# EAGLE design hydra (EAGLE 5.06)
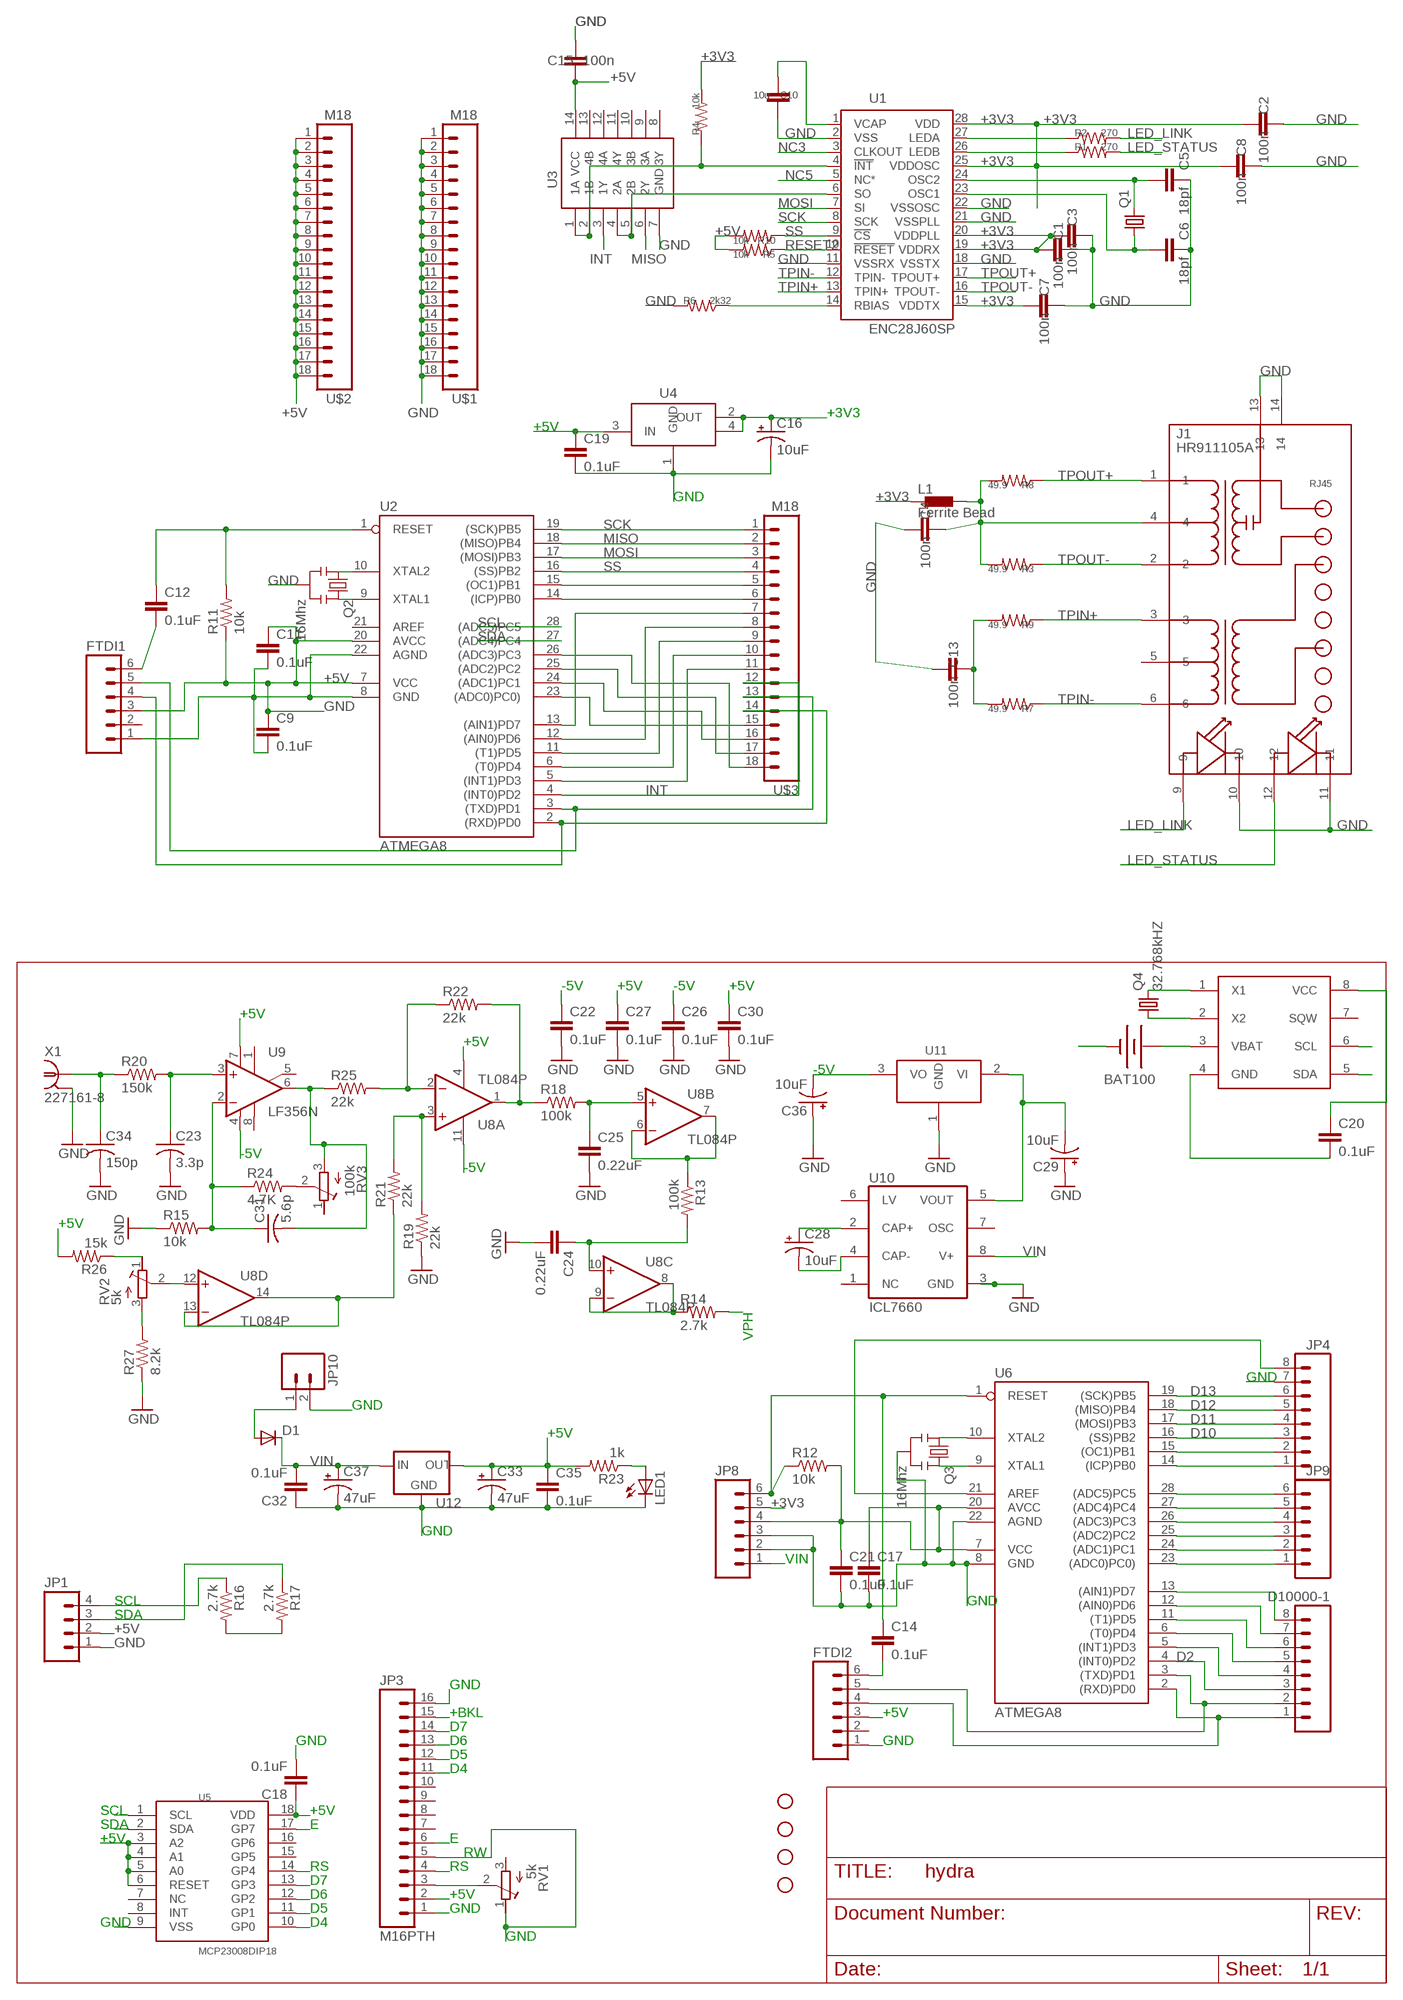
[diagram p0: schematic, sheet 1]

## Parts
BAT100  BATTERY12PTH_KEYSTONE  [BATT_12MM_KEYSTONE]
C1  100n  CAPPTH  [CAP-PTH-SMALL]
C2  100n  CAPPTH  [CAP-PTH-SMALL]
C3  100n  CAPPTH  [CAP-PTH-SMALL]
C4  100n  CAPPTH  [CAP-PTH-SMALL]
C5  18pf  CAPPTH  [CAP-PTH-SMALL]
C6  18pf  CAPPTH  [CAP-PTH-SMALL]
C7  100n  CAPPTH  [CAP-PTH-SMALL]
C8  100n  CAPPTH  [CAP-PTH-SMALL]
C9  0.1uF  CAPPTH  [CAP-PTH-SMALL]
C10  10u  CAPPTH  [CAP-PTH-SMALL]
C11  0.1uF  CAPPTH  [CAP-PTH-SMALL]
C12  0.1uF  CAPPTH  [CAP-PTH-SMALL]
C13  100n  CAPPTH  [CAP-PTH-SMALL]
C14  0.1uF  CAPPTH  [CAP-PTH-SMALL]
C15  100n  CAPPTH  [CAP-PTH-SMALL]
C16  10uF  CAP_POL5MMPTH  [CAP5MM2MM]
C17  0.1uF  CAPPTH  [CAP-PTH-SMALL]
C18  0.1uF  CAPPTH  [CAP-PTH-SMALL]
C19  0.1uF  CAPPTH  [CAP-PTH-SMALL]
C20  0.1uF  CAPPTH  [CAP-PTH-SMALL]
C21  0.1uF  CAPPTH  [CAP-PTH-SMALL]
C22  0.1uF  CAPPTH  [CAP-PTH-SMALL]
C23  3.3p  C-US025-025X050  [C025-025X050]
C24  0.22uF  CAPPTH  [CAP-PTH-SMALL]
C25  0.22uF  CAPPTH  [CAP-PTH-SMALL]
C26  0.1uF  CAPPTH  [CAP-PTH-SMALL]
C27  0.1uF  CAPPTH  [CAP-PTH-SMALL]
C28  10uF  CPOL-USE2-5  [E2-5]
C29  10uF  CPOL-USE2-5  [E2-5]
C30  0.1uF  CAPPTH  [CAP-PTH-SMALL]
C31  5.6p  C-US025-025X050  [C025-025X050]
C32  0.1uF  CAPPTH  [CAP-PTH-SMALL]
C33  47uF  CAP_POL6.3MMPTH  [CAP6.3MM2.5MM]
C34  150p  C-US025-025X050  [C025-025X050]
C35  0.1uF  CAPPTH  [CAP-PTH-SMALL]
C36  10uF  CPOL-USE2-5  [E2-5]
C37  47uF  CAP_POL6.3MMPTH  [CAP6.3MM2.5MM]
D1  DIODEPTH  [DIODE-1N4001]
D10000-1  M08  [1X08]
FTDI1  M06SIP  [1X06]
FTDI2  M06SIP  [1X06]
J1  HR911105A  [HR911105A]
JP1  M04PTH  [1X04]
JP2  STAND-OFF  [STAND-OFF]
JP3  M16PTH  [1X16]
JP4  M08  [1X08]
JP5  STAND-OFF  [STAND-OFF]
JP6  STAND-OFF  [STAND-OFF]
JP7  STAND-OFF  [STAND-OFF]
JP8  M06SIP  [1X06]
JP9  M06SIP  [1X06]
JP10  M02POLAR  [MOLEX-1X2]
L1  Ferrite Bead  BL01RN1A  [BL01RN1A]
LED1  LED3MM  [LED3MM]
Q1  CRYSTALHC49S  [HC49/S]
Q2  16Mhz  RESONATORPTH  [RESONATOR-PTH]
Q3  16Mhz  RESONATORPTH  [RESONATOR-PTH]
Q4  32.768kHZ  CRYSTALTC26H  [TC26H]
R1  270  R-US_0204/7  [0204/7]
R2  270  R-US_0204/7  [0204/7]
R3  49.9  R-US_0204/7  [0204/7]
R4  10k  R-US_0204/7  [0204/7]
R5  10k  R-US_0204/7  [0204/7]
R6  2k32  R-US_0204/7  [0204/7]
R7  49.9  R-US_0204/7  [0204/7]
R8  49.9  R-US_0204/7  [0204/7]
R9  49.9  R-US_0204/7  [0204/7]
R10  10k  R-US_0204/7  [0204/7]
R11  10k  R-US_0204/7  [0204/7]
R12  10k  R-US_0204/7  [0204/7]
R13  100k  R-US_0204/7  [0204/7]
R14  2.7k  R-US_0204/7  [0204/7]
R15  10k  R-US_0204/7  [0204/7]
R16  2.7k  R-US_0204/7  [0204/7]
R17  2.7k  R-US_0204/7  [0204/7]
R18  100k  R-US_0204/7  [0204/7]
R19  22k  R-US_0204/7  [0204/7]
R20  150k  R-US_0204/7  [0204/7]
R21  22k  R-US_0204/7  [0204/7]
R22  22k  R-US_0204/7  [0204/7]
R23  1k  R-US_0204/7  [0204/7]
R24  4.7K  R-US_0204/7  [0204/7]
R25  22k  R-US_0204/7  [0204/7]
R26  15k  R-US_0204/7  [0204/7]
R27  8.2k  R-US_0204/7  [0204/7]
RV1  5k  R-TRIMMT93YA  [RTRIMT93YA]
RV2  5k  R-TRIMMT93YA  [RTRIMT93YA]
RV3  100k  R-TRIMMT93YA  [RTRIMT93YA]
U1  ENC28J60SP  [DIL28-3]
U2  ATMEGA8  AT90S4433P  [DIL28-3]
U3  SN74HCT08NDIL14  [DIL14]
U4  LD1117  [SOT223]
U5  MCP23008DIP18  [DIL18]
U6  ATMEGA8  AT90S4433P  [DIL28-3]
U7  DS1307DS1307  [DIP08]
U8  TL084P  [DIL14]
U9  LF356N  [DIL08]
U10  ICL7660  ICL7660CPA  [DIL08]
U11  79XX  [TO92-]
U12  V_REG_78XXTO252  [TO252]
U$1  M18  [1X18]
U$2  M18  [1X18]
U$3  M18  [1X18]
X1  227161-8  [AMP_227161]

## Nets
+3V3: C1.2 C2.2 C3.2 C7.2 C8.2 C16.+ JP8.5 L1.1 R4.2 U1.15(VDDTX) U1.19(VDDRX) U1.20(VDDPLL) U1.25(VDDOSC) U1.28(VDD) U4.2(OUT) U4.4(TAB)
+5V [power]: C9.1 C11.1 C15.2 C17.1 C18.1 C19.1 C20.1 C21.1 C27.1 C30.1 C33.P$2(+) C35.1 FTDI1.3 FTDI2.3 JP1.2 JP3.2 JP8.4 R5.2 R10.2 R11.1 R12.2 R16.2 R17.2 R23.2 R26.2 U2.7(VCC) U2.20(AVCC) U3.14(VCC) U4.3(IN) U5.3(A2) U5.4(A1) U5.5(A0) U5.6(RESET) U5.18(VDD) U6.7(VCC) U6.20(AVCC) U7.8(VCC) U8.4(P:V+) U9.7(V+) U12.2(OUT) U$2.1 U$2.2 U$2.3 U$2.4 U$2.5 U$2.6 U$2.7 U$2.8 U$2.9 U$2.10 U$2.11 U$2.12 U$2.13 U$2.14 U$2.15 U$2.16 U$2.17 U$2.18
+BKL: JP3.15 JP4.1 U6.14((ICP)PB0)
-5V [power]: C22.1 C26.1 C36.- U8.11(P:V-) U9.4(V-) U11.3(VO)
BUZZ: D10000-1.8 U6.13((AIN1)PD7)
D2: D10000-1.3 U6.4((INT0)PD2)
D4: JP3.11 U5.10(GP0)
D5: JP3.12 U5.11(GP1)
D6: JP3.13 U5.12(GP2)
D7: JP3.14 U5.13(GP3)
D10: JP4.3 U6.16((SS)PB2)
D11: JP4.4 U6.17((MOSI)PB3)
D12: JP4.5 U6.18((MISO)PB4)
D13: JP4.6 U6.19((SCK)PB5)
E: JP3.6 U5.17(GP7)
GND [power]: BAT100.GND(-) C1.1 C2.1 C3.1 C4.2 C5.1 C6.1 C7.1 C8.1 C9.2 C10.1 C11.2 C13.2 C15.1 C16.- C17.2 C18.2 C19.2 C20.2 C21.2 C22.2 C23.2 C24.2 C25.2 C26.2 C27.2 C29.+ C30.2 C32.1 C33.P$1(-) C34.2 C35.2 C36.+ C37.P$1(-) FTDI1.1 FTDI2.1 J1.10 J1.11 J1.13 J1.14 JP1.1 JP3.1 JP3.5 JP3.16 JP4.7 JP8.2 JP8.3 JP10.2 LED1.K(C) Q2.2 Q3.2 R6.2 R15.1 R19.1 R27.1 RV1.1(A) U1.2(VSS) U1.11(VSSRX) U1.18(VSSTX) U1.21(VSSPLL) U1.22(VSSOSC) U2.8(GND) U2.22(AGND) U3.7(GND) U4.1(GND) U5.9(VSS) U6.8(GND) U6.22(AGND) U7.4(GND) U10.3(GND) U11.1(GND) U12.3(GND) U$1.1 U$1.2 U$1.3 U$1.4 U$1.5 U$1.6 U$1.7 U$1.8 U$1.9 U$1.10 U$1.11 U$1.12 U$1.13 U$1.14 U$1.15 U$1.16 U$1.17 U$1.18 X1.2(GND)
INT: U2.4((INT0)PD2) U3.3(1Y) U$3.12
IR: D10000-1.5 U6.6((T0)PD4)
LED_LINK: J1.9 R2.2
LED_STATUS: J1.12 R1.2
MISO: U2.18((MISO)PB4) U3.6(2Y) U$3.2
MOSI: U1.7(SI) U2.17((MOSI)PB3) U$3.3
N$1: Q4.1 U7.2(X2)
N$2: Q4.2 U7.1(X1)
N$3: BAT100.V+(+) U7.3(VBAT)
N$4: C28.+ U10.2(CAP+)
N$5: C28.- U10.4(CAP-)
N$6: C31.2 R25.1 RV3.3(E) U9.6(OUT)
N$7: R22.1 R25.2 U8.2(A:-IN)
N$8: C23.1 R20.2 U9.3(+IN)
N$10: JP3.3 RV1.2(S)
N$11: R24.2 RV3.2(S)
N$12: R19.2 R21.2 U8.3(A:+IN)
N$13: C34.1 R20.1 X1.1
N$14: C31.1 R15.2 R24.1 U9.2(-IN)
N$15: R18.1 R22.2 U8.1(A:OUT)
N$16: C25.1 R18.2 U8.5(B:+IN)
N$17: R13.1 U8.6(B:-IN) U8.7(B:OUT)
N$18: C24.1 R13.2 U8.10(C:+IN)
N$19: RV2.2(S) U8.12(D:+IN)
N$20: R21.1 U8.13(D:-IN) U8.14(D:OUT)
N$21: R14.1 U8.8(C:OUT) U8.9(C:-IN)
N$22: R26.1 RV2.1(A)
N$23: R27.2 RV2.3(E)
N$24: LED1.A R23.1
N$25: D10000-1.4 U6.5((INT1)PD3)
N$26: U2.26((ADC3)PC3) U$3.18
N$27: U2.25((ADC2)PC2) U$3.17
N$28: D10000-1.6 U6.11((T1)PD5)
N$29: D10000-1.7 U6.12((AIN0)PD6)
N$30: C10.2 U1.1(VCAP)
N$31: JP9.1 U6.23((ADC0)PC0))
N$32: JP9.2 U6.24((ADC1)PC1)
N$33: R6.1 U1.14(RBIAS)
N$34: JP9.3 U6.25((ADC2)PC2)
N$35: C4.1 J1.4 L1.2 R3.2 R8.2
N$36: Q3.3 U6.9(XTAL1)
N$37: C13.1 R7.2 R9.2
N$38: Q3.1 U6.10(XTAL2)
N$39: R2.1 U1.27(LEDA)
N$40: JP4.2 U6.15((OC1)PB1)
N$42: R1.1 U1.26(LEDB)
N$43: D1.A JP10.1
N$45: JP4.8 U6.21(AREF)
N$47: U2.24((ADC1)PC1) U$3.16
N$49: D10000-1.1 FTDI2.4 U6.2((RXD)PD0)
N$50: D10000-1.2 FTDI2.5 U6.3((TXD)PD1)
N$51: C14.2 FTDI2.6
N$52: U2.23((ADC0)PC0)) U$3.15
N$53: FTDI1.4 U2.2((RXD)PD0) U$3.14
N$54: FTDI1.5 U2.3((TXD)PD1) U$3.13
N$56: U2.5((INT1)PD3) U$3.11
N$57: U2.6((T0)PD4) U$3.10
N$58: U2.11((T1)PD5) U$3.9
N$59: U2.12((AIN0)PD6) U$3.8
N$60: U2.13((AIN1)PD7) U$3.7
N$61: U2.14((ICP)PB0) U$3.6
N$62: U2.15((OC1)PB1) U$3.5
N$67: Q2.1 U2.10(XTAL2)
N$68: Q2.3 U2.9(XTAL1)
N$69: C12.2 FTDI1.6
NC3: U1.3(CLKOUT)
NC5: U1.5(NC*)
OSC1: C6.2 Q1.1 U1.23(OSC1)
OSC2: C5.2 Q1.2 U1.24(OSC2)
RESET: C14.1 JP8.6 R12.1 U6.1(RESET)
RESET2: C12.1 R5.1 R11.2 U1.10(!RESET) U2.1(RESET)
RS: JP3.4 U5.14(GP4)
SCK: U1.8(SCK) U2.19((SCK)PB5) U$3.1
SCL: JP1.4 JP9.6 R16.1 U2.28((ADC5)PC5) U5.1(SCL) U6.28((ADC5)PC5) U7.6(SCL)
SDA: JP1.3 JP9.5 R17.1 U2.27((ADC4)PC4) U5.2(SDA) U6.27((ADC4)PC4) U7.5(SDA)
SS: R10.1 U1.9(!CS) U2.16((SS)PB2) U$3.4
TP1: R4.1 U1.4(!INT) U3.1(1A) U3.2(1B)
TP2: U1.6(SO) U3.4(2A) U3.5(2B)
TPIN+: J1.3 R9.1 U1.13(TPIN+)
TPIN-: J1.6 R7.1 U1.12(TPIN-)
TPOUT+: J1.1 R8.1 U1.17(TPOUT+)
TPOUT-: J1.2 R3.1 U1.16(TPOUT-)
U5VIN [power]: C29.- U10.5(VOUT) U11.2(VI)
VIN [power]: C32.2 C37.P$2(+) D1.C JP8.1 U10.8(V+) U12.1(IN)
VPH: JP9.4 R14.2 U6.26((ADC3)PC3)
Unconnected: FTDI1.2 FTDI2.2 J1.5 JP3.7 JP3.8 JP3.9 JP3.10 RV1.3(E) RV3.1(A) U2.21(AREF) U3.8(3Y) U3.9(3A) U3.10(3B) U3.11(4Y) U3.12(4A) U3.13(4B) U5.7(NC) U5.8(INT) U5.15(GP5) U5.16(GP6) U7.7(SQW) U9.1(ON1) U9.5(ON2) U9.8(OPT) U10.1(NC) U10.6(LV) U10.7(OSC)

## Notes on the sheet
- +3V3
- +5V
- GND
- -5V | +5V | -5V | +5V
- +5V
- +5V
- -5V
- -5V
- -5V
- +5V
- VPH
- GND
- GND
- +5V
- GND
- VIN
- SCL | GND
- SDA
- GND
- +BKL | +5V
- D7
- GND | D6 | GND
- D5
- D4
- SCL | +5V
- SDA | E
- +5V | E
- RW
- RS | RS
- D7
- D6 | +5V
- D5 | GND
- GND | D4
- GND

## Library data of the parts
BAT100 = _allyourbase:BATTERY: Battery Holders Various common sizes : AA, AAA, 20mm coin cell and 12mm coin cell.
C1-C15 C17-C22 C24-C27 C30 C32 C35 = _allyourbase:CAP: Capacitor Standard 0603 ceramic capacitor, and 0.1" leaded capacitor.
C16 C33 C37 = _allyourbase:CAP_POL: Capacitor Polarized These are standard SMD and PTH capacitors. Normally 10uF, 47uF, and 100uF in electrolytic and tantalum varieties. Always verify the external diameter of the through hole cap, it varies with capacity, voltage, and manufacturer. The EIA devices should be standard.
C23 C31 C34 = rcl:C-US: CAPACITOR, American symbol
C28 C29 C36 = rcl:CPOL-US: POLARIZED CAPACITOR, American symbol
D1 = _allyourbase:DIODE: Diode These are standard reverse protection diodes and small signal diodes. SMA package can handle up to about 1A. SOD-323 can handle about 200mA. What the SOD-323 package when ordering, there are some mfgs out there that are 5-pin packages.
D10000-1 JP4 = _allyourbase:M08: Header 8 Standard 8-pin 0.1" header. Use with straight break away headers (SKU : PRT-00116), right angle break away headers (PRT-00553), swiss pins (PRT-00743), machine pins (PRT-00117), and female headers (PRT-00115).
FTDI1 FTDI2 JP8 JP9 = _allyourbase:M06: Header 6 Standard 6-pin 0.1" header. Use with straight break away headers (SKU : PRT-00116), right angle break away headers (PRT-00553), swiss pins (PRT-00743), machine pins (PRT-00117), and female headers (PRT-00115). Molex polarized connector foot print use with SKU : PRT-08094 with associated crimp pins and housings. NOTES ON THE VARIANTS LOCK and LOCK_LONGPADS... This footprint was designed to help hold the alignment of a through-hole component (i.e. 6-pin header) while soldering it into place. You may notice that each hole has been shifted either up or down by 0.005 of an inch from it's more standard position (which is a perfectly straight line). This slight alteration caused the pins (the squares in the middle) to touch the edges of the holes. Because they are alternating, it causes a "brace" to hold the component in place. 0.005 has proven to be the perfect amount of "off-center" position when using our standard breakaway headers. Although looks a little odd when you look at the bare footprint, once you have a header in there, the alteration is very hard to notice. Also, if you push a header all the way into place, it is covered up entirely on the bottom side. This idea of altering the position of holes to aid alignment will be further integrated into the Sparkfun Library for other footprints. It can help hold any component with 3 or more connection pins.
J1 = _allyourbase:HR911105A
JP1 = _allyourbase:M04: Header 4 Standard 4-pin 0.1" header. Use with straight break away headers (SKU : PRT-00116), right angle break away headers (PRT-00553), swiss pins (PRT-00743), machine pins (PRT-00117), and female headers (PRT-00115). Molex polarized connector foot print use with SKU : PRT-08231 with associated crimp pins and housings.
JP2 JP5-JP7 = _allyourbase:STAND-OFF: Stand Off This is the mechanical footprint for a #4 phillips button head screw. Use the keepout ring to avoid running the screw head into surrounding components. SKU : PRT-00447
JP3 = SparkFun:M16
JP10 = _allyourbase:M02: Header 2 Standard 2-pin 0.1" header. Use with straight break away headers (SKU : PRT-00116), right angle break away headers (PRT-00553), swiss pins (PRT-00743), machine pins (PRT-00117), and female headers (PRT-00115). Molex polarized connector foot print use with SKU : PRT-08233 with associated crimp pins and housings.
L1 = inductors:BL0: Noise Suppression Products/EMI Suppression Filters, Lead EMIFIL(R) Inductor Type Source: http://www.murata.com .. BL01RN1_DS.pdf
LED1 = SparkFun:LED: LEDs Standard schematic elements and footprints for 5mm, 3mm, 1206, and 0603 sized LEDs. 5mm - Spark Fun Electronics SKU : COM-00529 (and others)
Q1 Q4 = _allyourbase:CRYSTAL: CRYSTAL
Q2 Q3 = _allyourbase:RESONATOR: Resonator Small SMD resonator. This is the itty bitty 10/20MHz resonators with built in caps. CSTCE10M0G55 and CSTCE20M0V53. Footprint has been reviewed closely but hasn't been tested yet.
R1-R27 = _allyourbase:R-US_: RESISTOR, American symbol
RV1-RV3 = resistor:R-TRIMM: Trimm resistor
U1 = _allyourbase:ENC28J60: Stand-Alone Ethernet Controller with SPI Interface Source: http://ww1.microchip.com/downloads/en/DeviceDoc/39662c.pdf
U2 U6 = atmel:AT90S4433: MICROCONTROLLER 4 Kbytes FLASH 128 bytes SRAM 256 bytes EEPROM UART 6-channel 10 bit ADC
U3 = _allyourbase:SN74HCT08N
U4 = _allyourbase:LD1117
U5 = _allyourbase:MCP23008
U7 = _allyourbase:DS1307
U8 = _allyourbase:TL084: OP AMP
U9 = _allyourbase:LF356: OP AMP
U10 = _allyourbase:ICL7660CPA: VOLTAGE CONVERTER
U11 = _allyourbase:79XX
U12 = _allyourbase:V_REG_78XX: Voltage Regulator Standard 7805 5V regulator. IGO (Input Ground Output). Spark Fun Electronics SKU : COM-00107
U$1-U$3 = _allyourbase:M18
X1 = con-coax:?227161*: JACK, RIGHT ANGLE, 50 OHM, PCB, BNC Source: amp_227161.pdf

## Net classes
0 default: width 0.203 mm, drill 0.508 mm, clearance 0.203 mm
1 power: width 0.254 mm, drill 0.508 mm, clearance 0.203 mm

## Board
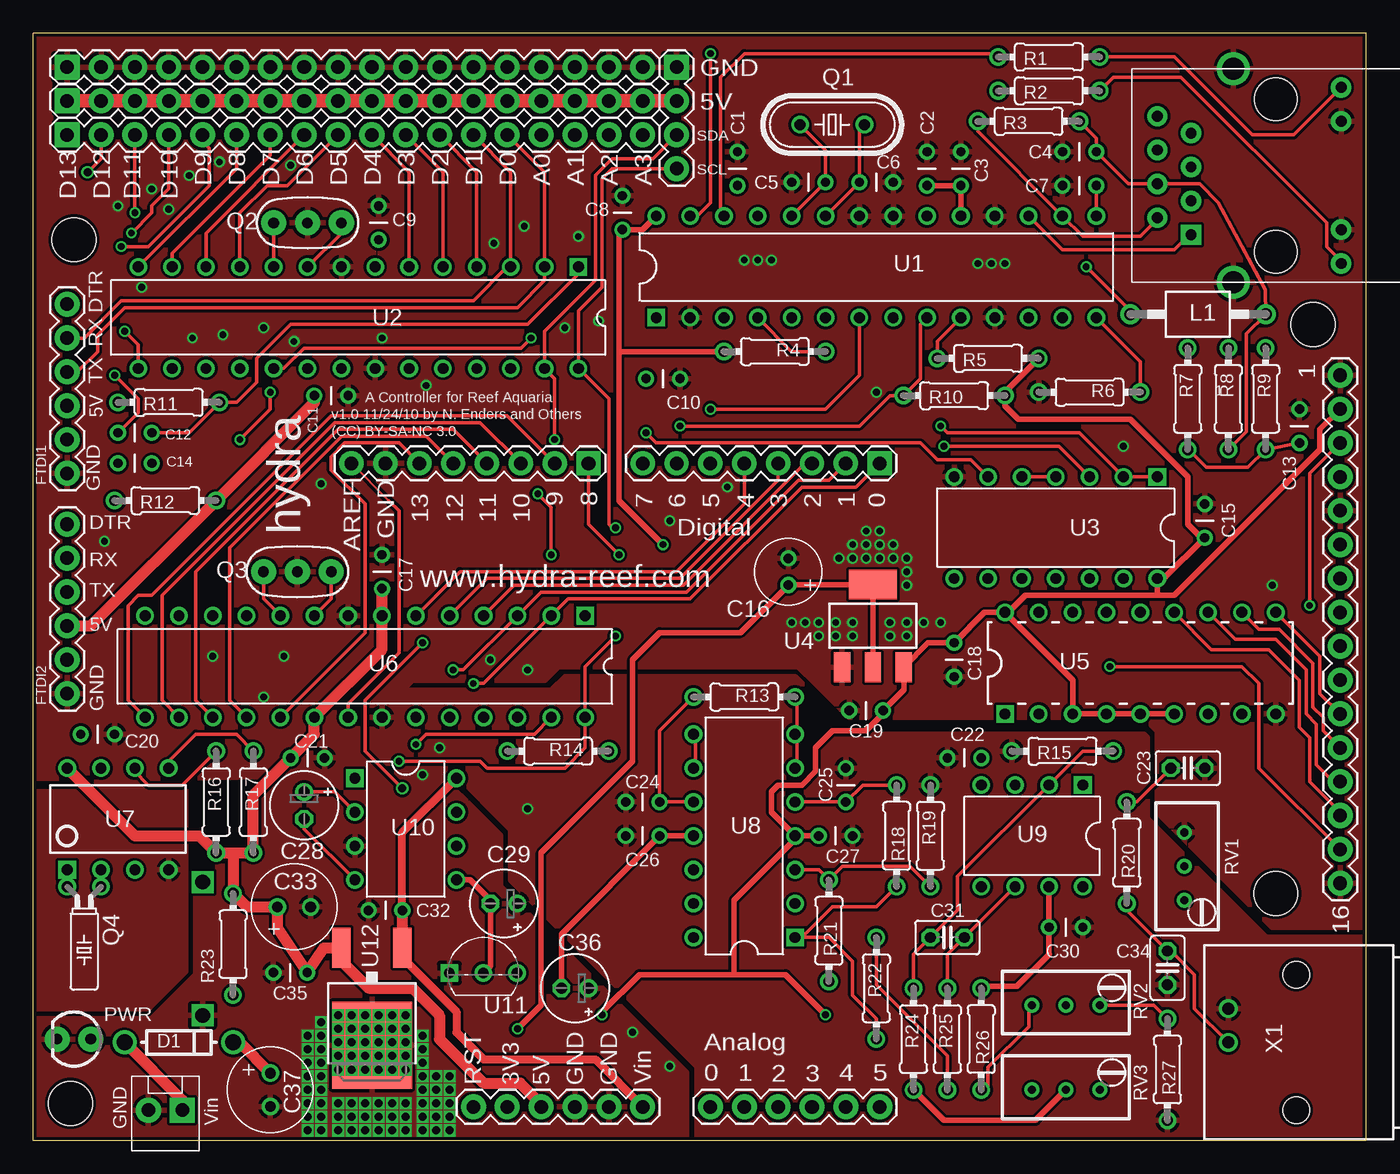
[diagram p1: board, top side]
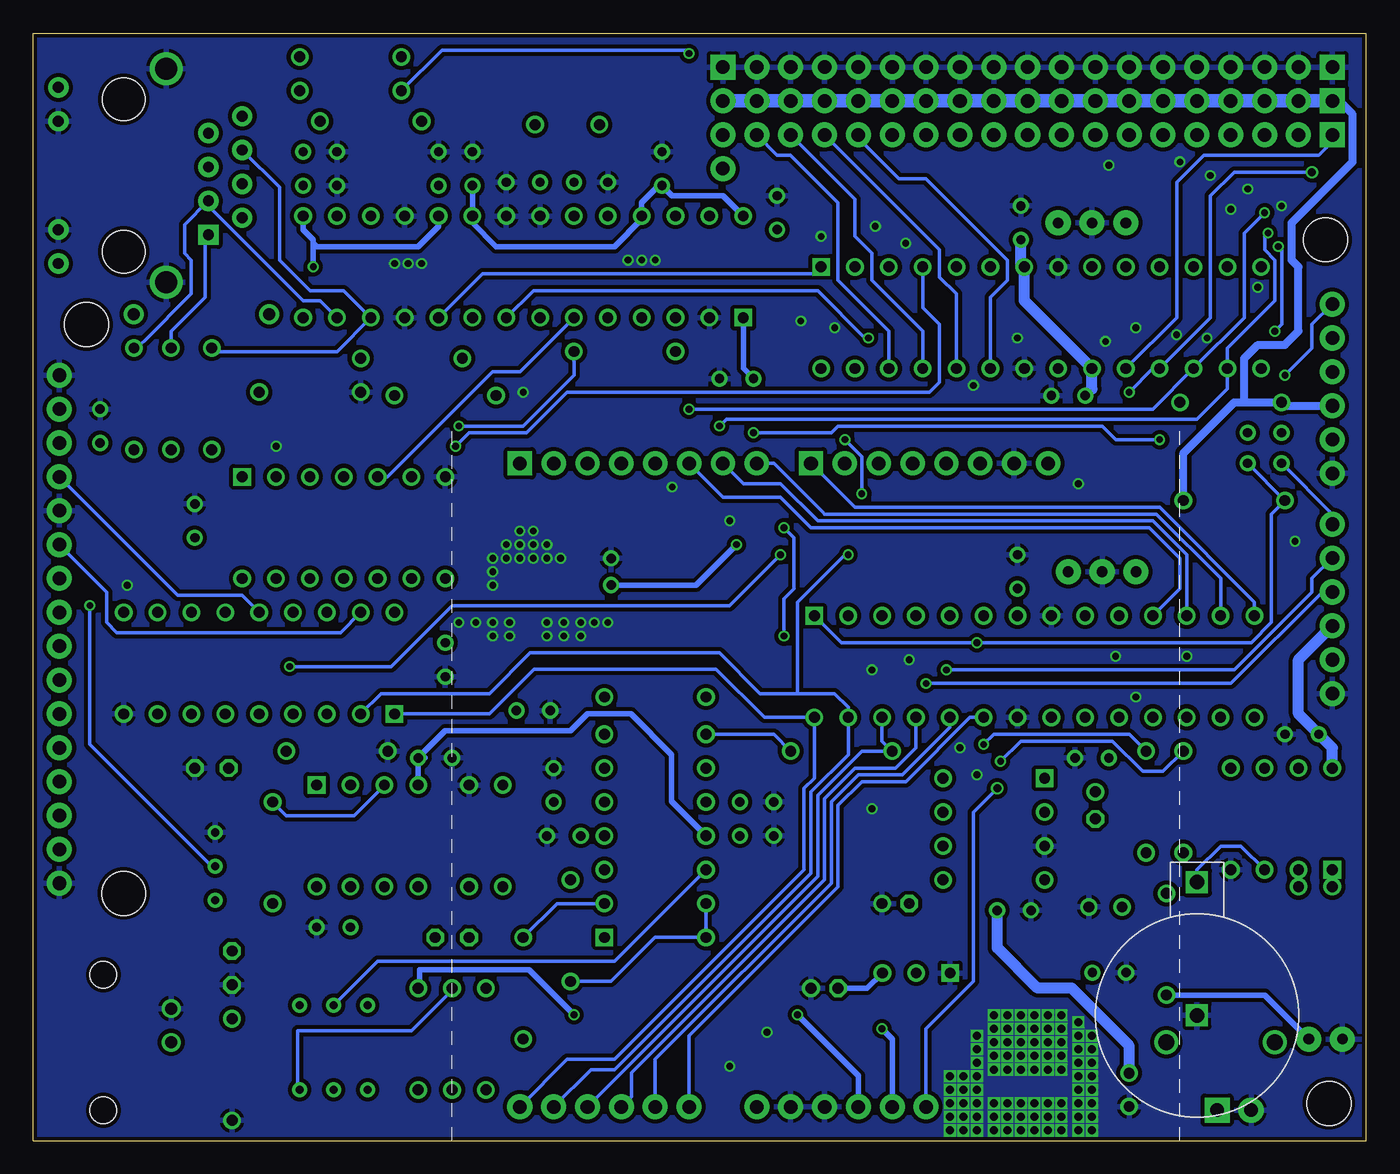
[diagram p2: board, bottom side, seen from below]

Size 100 x 83.05 mm. Coordinates in mm from the lower left corner, seen from the top.
Outline: 100,0 0,0 0,83.05 100,83.05 100,0
Copper layers (1*16): Top 0.035mm / dielectric 1.5mm / Bottom 0.035mm
Design rules "Fusion_eagle_rule_v1.1": minimum track width 6mil, minimum drill 12mil, track to track 6mil, track to pad 6mil, pad to pad 6mil, via to via 6mil, smd to smd 0mil, copper to edge 10mil, drill to drill 10mil, minimum pad ring 10mil, minimum via ring 6mil, stop-mask expansion 2mil, vias tented up to drill 100mil, thermal gap 10mil

### Footprints (pad centres in the part's own frame; a part is rotated, then mirrored left to right if it is on the bottom)
BATT_12MM_KEYSTONE = drill 1.1 square: GND 0,0; V+ 10,0
CAP-PTH-SMALL = drill 0.7 round: 1 0,0; 2 2.54,0
CAP5MM2MM = drill 0.7 round: + 1,0; - -1,0
C025-025X050 = drill 0.813 octagon: 1 -1.27,0; 2 1.27,0
E2-5 = drill 0.813 pad 1.27 round: + -1.016,0 | drill 0.813 pad 1.27 octagon: - 1.016,0
CAP6.3MM2.5MM = drill 0.8 round: P$1 -1.25,0; P$2 1.25,0
DIODE-1N4001 = drill 1.2 round: A -4.33,0; C 3.83,0
1X08 = drill 1.016 pad 1.829 square: 1 0,0 | drill 1.016 pad 1.829 round: 2 2.54,0; 3 5.08,0; 4 7.62,0; 5 10.16,0; 6 12.7,0; 7 15.24,0; 8 17.78,0
1X06 = drill 1.016 pad 1.88 round: 1 0,0; 2 2.54,0; 3 5.08,0; 4 7.62,0; 5 10.16,0; 6 12.7,0
HR911105A = drill 0.813 pad 1.524 square: 1 4.445,-6.35 | drill 0.813 pad 1.524 round: 2 3.175,-8.89; 3 1.905,-6.35; 4 0.635,-8.89; 5 -0.635,-6.35; 6 -1.905,-8.89; 7 -3.175,-6.35; 8 -4.445,-8.89; 9 6.604,4.902; 10 4.064,4.902; 11 -4.064,4.902; 12 -6.604,4.902 | drill 1.651 pad 2.159 round: 13 8.001,-3.175; 14 -8.001,-3.175 | hole 3.2: 5.715,0; -5.715,0
1X04 = drill 1.016 pad 1.88 square: 1 0,0 | drill 1.016 pad 1.88 round: 2 2.54,0; 3 5.08,0; 4 7.62,0
STAND-OFF = hole 3.302: 0,0
1X16 = drill 1.016 pad 1.88 round: 1 0,0; 2 2.54,0; 3 5.08,0; 4 7.62,0; 5 10.16,0; 6 12.7,0; 7 15.24,0; 8 17.78,0; 9 20.32,0; 10 22.86,0; 11 25.4,0; 12 27.94,0; 13 30.48,0; 14 33.02,0; 15 35.56,0; 16 38.1,0
MOLEX-1X2 = drill 1.016 pad 1.88 square: 1 0,0 | drill 1.016 pad 1.88 round: 2 2.54,0
BL01RN1A = drill 0.9 pad 1.5 round: 1 -5.08,0; 2 5.08,0
LED3MM = drill 0.813 pad 1.88 round: A -1.27,0; K 1.27,0
HC49/S = drill 0.813 round: 1 -2.413,0; 2 2.413,0
RESONATOR-PTH = drill 0.8 pad 1.88 round: 1 -2.54,0; 2 0,0; 3 2.54,0
TC26H = drill 0.813 round: 1 -1.27,0; 2 1.27,0
0204/7 = drill 0.813 round: 1 -3.81,0; 2 3.81,0
RTRIMT93YA = drill 0.61 round: 1 0,-2.54; 2 0,0; 3 0,2.54
DIL28-3 = drill 0.813 square: 1 -16.51,-3.81 | drill 0.813 round: 2 -13.97,-3.81; 3 -11.43,-3.81; 4 -8.89,-3.81; 5 -6.35,-3.81; 6 -3.81,-3.81; 7 -1.27,-3.81; 8 1.27,-3.81; 9 3.81,-3.81; 10 6.35,-3.81; 11 8.89,-3.81; 12 11.43,-3.81; 13 13.97,-3.81; 14 16.51,-3.81; 15 16.51,3.81; 16 13.97,3.81; 17 11.43,3.81; 18 8.89,3.81; 19 6.35,3.81; 20 3.81,3.81; 21 1.27,3.81; 22 -1.27,3.81; 23 -3.81,3.81; 24 -6.35,3.81; 25 -8.89,3.81; 26 -11.43,3.81; 27 -13.97,3.81; 28 -16.51,3.81
DIL14 = drill 0.813 square: 1 -7.62,-3.81 | drill 0.813 round: 2 -5.08,-3.81; 3 -2.54,-3.81; 4 0,-3.81; 5 2.54,-3.81; 6 5.08,-3.81; 7 7.62,-3.81; 8 7.62,3.81; 9 5.08,3.81; 10 2.54,3.81; 11 0,3.81; 12 -2.54,3.81; 13 -5.08,3.81; 14 -7.62,3.81
SOT223 = smd 1.219 x 2.235: 1 -2.311,-3.099; 2 0,-3.099; 3 2.311,-3.099 | smd 3.6 x 2.2: 4 0,3.099
DIL18 = drill 0.813 square: 1 -10.16,-3.81 | drill 0.813 round: 2 -7.62,-3.81; 3 -5.08,-3.81; 4 -2.54,-3.81; 5 0,-3.81; 6 2.54,-3.81; 7 5.08,-3.81; 8 7.62,-3.81; 9 10.16,-3.81; 10 10.16,3.81; 11 7.62,3.81; 12 5.08,3.81; 13 2.54,3.81; 14 0,3.81; 15 -2.54,3.81; 16 -5.08,3.81; 17 -7.62,3.81; 18 -10.16,3.81
DIP08 = drill 0.813 square: 1 -3.81,-3.81 | drill 0.813 round: 2 -1.27,-3.81; 3 1.27,-3.81; 4 3.81,-3.81; 5 3.81,3.81; 6 1.27,3.81; 7 -1.27,3.81; 8 -3.81,3.81
DIL08 = drill 0.813 square: 1 -3.81,-3.81 | drill 0.813 round: 2 -1.27,-3.81; 3 1.27,-3.81; 4 3.81,-3.81; 5 3.81,3.81; 6 1.27,3.81; 7 -1.27,3.81; 8 -3.81,3.81
TO92- = drill 0.813 square: 1 -2.54,0 | drill 0.813 round: 2 0,0; 3 2.54,0
TO252 = smd 1.4 x 3: 1 -2.28,-4.8; 2 2.28,-4.8 | smd 6 x 6.5: 3 0,2.5
1X18 = drill 1.016 pad 1.88 square: 1 0,0 | drill 1.016 pad 1.88 round: 2 2.54,0; 3 5.08,0; 4 7.62,0; 5 10.16,0; 6 12.7,0; 7 15.24,0; 8 17.78,0; 9 20.32,0; 10 22.86,0; 11 25.4,0; 12 27.94,0; 13 30.48,0; 14 33.02,0; 15 35.56,0; 16 38.1,0; 17 40.64,0; 18 43.18,0
AMP_227161 = drill 0.9 pad 1.27 round: 1 0,-5.08; 2 -2.54,-5.08 | hole 2: -5.08,0; 5.08,0

### Placement (x,y rotation side)
BAT100  12.7,9.4 90 bottom
C1  52.83,74.17 270 top
C2  67.06,74.17 270 top
C3  69.6,74.17 270 top
C4  79.76,74.17 180 top
C5  56.9,71.88 0 top
C6  64.52,71.88 180 top
C7  77.22,71.63 0 top
C8  44.2,70.87 270 top
C9  25.91,67.56 90 top
C10  48.51,57.15 180 top
C11  21.08,55.88 0 top
C12  8.89,53.09 180 top
C13  95,52.32 90 top
C14  8.89,50.8 180 top
C15  87.88,47.75 270 top
C16  56.64,42.67 270 top
C17  26.16,41.4 90 top
C18  69.09,37.34 270 top
C19  63.75,32.26 180 top
C20  3.56,30.48 0 top
C21  19.3,28.7 0 top
C22  71.12,28.7 180 top
C23  86.61,27.94 0 top
C24  46.99,25.4 180 top
C25  60.96,25.4 90 top
C26  46.99,22.86 180 top
C27  58.93,22.86 0 top
C28  20.32,25.15 270 top
C29  35.31,17.78 180 top
C30  76.2,16 0 top
C31  68.58,15.24 0 top
C32  25.15,17.27 0 top
C33  19.56,17.53 180 top
C34  85.09,12.95 270 top
C35  20.55,12.6 180 top
C36  40.64,11.43 180 top
C37  17.78,3.81 90 top
D1  11.18,7.37 0 top
D10000-1  63.5,50.8 180 top
FTDI1  2.54,50.04 90 top
FTDI2  2.54,33.53 90 top
J1  93.22,72.39 270 top
JP1  48.26,80.52 270 top
JP2  96.01,61.21 0 top
JP3  98.04,57.4 270 top
JP4  41.66,50.8 180 top
JP5  3.05,67.56 0 top
JP6  93.22,18.54 0 top
JP7  2.79,2.79 0 top
JP8  45.72,2.54 180 top
JP9  50.8,2.54 0 top
JP10  11.18,2.29 180 top
L1  87.38,61.98 0 top
LED1  3.05,7.62 180 top
Q1  59.94,76.2 180 top
Q2  20.57,68.83 0 top
Q3  19.81,42.67 0 top
Q4  3.81,19.05 180 top
R1  76.2,81.28 0 top
R2  76.2,78.74 0 top
R3  74.68,76.45 0 top
R4  55.63,59.18 180 top
R5  71.63,58.67 0 top
R6  79.25,56.13 180 top
R7  86.61,55.63 270 top
R8  89.66,55.63 270 top
R9  92.46,55.63 270 top
R10  69.09,55.88 0 top
R11  10.16,55.37 0 top
R12  9.91,48.01 0 top
R13  53.34,33.27 180 top
R14  39.37,29.21 180 top
R15  77.22,29.21 0 top
R16  13.72,25.4 270 top
R17  16.51,25.4 270 top
R18  64.77,22.86 90 top
R19  67.31,22.86 270 top
R20  82.04,21.59 90 top
R21  59.69,15.75 90 top
R22  63.25,11.43 270 top
R23  14.99,14.73 90 top
R24  66.04,7.62 270 top
R25  68.58,7.62 270 top
R26  71.12,7.62 90 top
R27  85.09,5.33 90 top
RV1  86.36,20.57 180 top
RV2  77.47,10.16 270 top
RV3  77.47,3.81 270 top
U1  63.25,65.53 0 top
U2  24.38,61.72 180 top
U3  76.71,45.97 180 top
U4  62.99,38.61 0 top
U5  83.06,35.81 0 top
U6  24.89,35.56 180 top
U7  6.35,24.13 0 top
U8  53.34,22.86 90 top
U9  74.93,22.86 180 top
U10  27.94,23.37 270 top
U11  33.76,12.57 0 top
U12  25.4,9.65 180 top
U$1  2.54,80.52 0 top
U$2  2.54,77.98 0 top
U$3  2.54,75.44 0 top
X1  94.74,7.37 270 top

### Tracks (layer width: path | path; a pad name or v marks a point on that pad's centre or on a via)
+3V3  (via drill 0.51)
  Top 0.254: U1.15 C7.2 | L1.1 82.3,62.23 v78.99,65.53
  Top 0.406: C2.2 C3.2 U1.19 | U4.2 U4.4 56.68,41.71 C16.+ 53.07,38.1 46.99,38.1 44.96,36.07 44.96,28.45 38.1,21.59 38.1,10.16 v36.32,8.38 | v47.24,44.7 43.94,48.01 43.94,59.18 | 43.94,59.18 R4.2 | 43.94,59.18 43.94,68.07 C8.2 45.72,68.33 U1.28
  Bottom 0.406: C16.+ 50.28,41.67 v47.24,44.7 | JP8.5 35.56,7.62 v36.32,8.38 | U1.15 79.76,68.33 78.99,67.56 78.99,67.31 | 78.99,67.31 v78.99,65.53 | U1.28 48.26,70.87 52.07,70.87 C1.2 53.09,71.63 54.36,70.36 U1.25 54.36,69.09 56.39,67.06 65.28,67.06 67.06,68.83 U1.20 C2.2 | U1.19 69.6,68.58 71.12,67.06 78.74,67.06 78.99,67.31
+5V  (via drill 0.51)
  Top 0.254: C15.2 87.63,45.21
  Top 0.406: R26.2 71.32,11.58 73.81,11.58 76.22,13.99 76.2,14.02 C30.1 U9.7 | 2.44,27.74 U7.8 | U8.4 57.15,22.61 52.58,18.03 52.58,12.45 | U8.4 C27.1 | U8.4 55.37,24.64 55.37,26.16 55.88,26.67 57.66,26.67 58.67,27.69 58.67,29.46 59.94,30.73 62.48,30.73 63.75,32 C19.1 65.3,33.81 U4.3 67.13,37.34 C18.1 71.37,39.62 U5.18 | 38.1,2.74 JP8.4 | U5.18 77.98,34.54 U5.3 U5.4 U5.5 U5.6 | 84.33,40.89 74.42,40.89 73.15,39.62 U5.18 | 84.33,40.89 85.6,40.89 96.52,51.82 96.52,53.34 JP3.2 | v42.67,9.45 42.67,9.65 45.47,12.45 52.58,12.45 | 52.58,12.45 56.44,12.45 v59.44,9.45 | C15.2 84.84,42.16 U3.14 84.33,40.89 | 82.93,53.47 86.61,49.78 86.61,46.23 87.63,45.21 | 82.93,53.47 82.8,53.59 | R5.2 72.9,56.13 R10.2 72.9,55.12 73.91,54.1 82.3,54.1 82.93,53.47
  Top 0.813: U7.8 7.62,22.86 12.45,22.86 R16.2 14.73,21.59 | 14.73,21.59 R17.2 16.51,25.91 C21.1 21.08,30.48 U6.20 26.16,36.83 U6.7 C17.1 | 38.1,2.74 36.52,4.32 33.78,4.32 30.48,7.62 30.48,9.4 28.45,11.43 25.15,11.43 23.12,13.46 U12.2 21.82,14.45 C35.1 18.31,15.98 C33.P$2 16,17.53 R23.2 14.99,21.34 14.73,21.59 | C11.1 21.08,55.37 R12.2 4.32,38.61 FTDI2.3
  Top 1.016: U$2.1 U$2.18 JP1.2
  Bottom 0.406: R26.2 71.02,11.58 71.02,12.8 62.79,12.8 v59.44,9.45 | v42.67,9.45 38.1,4.88 JP8.4 | U2.7 25.91,65.79
  Bottom 0.61: 9.14,55.37 9.91,55.37 13.72,51.56 R12.2 | 9.14,55.37 R11.1 6.1,55.12 FTDI1.3 | U$2.1 2.03,77.98 1.02,76.96 1.02,73.41 5.59,68.83 5.59,66.04 5.08,65.53 5.08,60.71 6.1,59.69 8.13,59.69 9.14,58.67 9.14,55.37
  Bottom 0.813: U2.7 25.65,62.99 U2.20 20.57,56.39 C11.1 | 25.91,65.79 C9.1 | U7.8 2.54,29.46 C20.1 5.08,32 5.08,36.07 FTDI2.3
  Bottom 1.016: U$2.1 U$2.2 U$2.3 U$2.4 U$2.5 U$2.6 U$2.7 U$2.8 U$2.9 U$2.10 U$2.11 U$2.12 U$2.13 U$2.14 U$2.15 U$2.16 U$2.17 U$2.18 JP1.2
+BKL  (via drill 0.51)
  Top 0.254: v80.77,35.56 90.68,35.56 91.95,34.29 91.95,27.94 JP3.15 | v43.94,43.94 41.66,46.23 JP4.1
  Bottom 0.254: v80.77,35.56 73.15,35.56 68.58,40.13 47.75,40.13 v43.94,43.94 | JP4.1 38.35,47.5 15.49,47.5 8.38,40.39 U6.14
-5V
  Top 0.406: U8.11 C26.1 39.62,15.49 C36.-
  Bottom 0.406: U8.11 52.12,25.45 52.12,28.96 55.17,32 58.42,32 59.69,30.73 69.09,30.73 C22.1 | C22.1 70.61,28.7 | C22.1 U9.4 | C36.- 37.44,11.43 U11.3
BUZZ
  Bottom 0.254: D10000-1.8 44.45,50.8 40.77,47.12 40.64,46.99 15.75,46.99 10.92,42.16 U6.13
D2
  Top 0.254: D10000-1.3 57.91,50.8 48.77,41.66 36.07,41.66 U6.4
D4
  Top 0.254: U5.10 96.52,36.32 96.52,33.53 JP3.11
D5
  Top 0.254: U5.11 91.95,38.35 93.47,38.35 96.01,35.81 96.01,32.51 96.77,31.75 96.77,30.73 JP3.12
D6
  Top 0.254: U5.12 90.17,37.59 93.22,37.59 95.5,35.31 95.5,32 96.27,31.24 96.27,28.19 97.54,26.92 JP3.13
D7
  Top 0.254: U5.13 88.39,36.83 92.71,36.83 95,34.54 95,30.99 95.76,30.23 95.76,26.92 98.04,24.64 JP3.14
D10
  Top 0.254: JP4.3 33.53,53.85 22.61,53.85 9.65,40.89 9.65,33.02 U6.16
D11
  Top 0.254: JP4.4 31.5,53.34 22.86,53.34 12.19,42.67 12.19,33.02 U6.17
D12
  Top 0.254: JP4.5 29.46,52.83 23.11,52.83 14.73,44.45 14.73,33.02 U6.18
D13
  Top 0.254: JP4.6 27.43,52.32 23.37,52.32 22.35,51.31 22.35,50.29 24.89,47.75 24.89,38.1 U6.19
E
  Bottom 0.254: U5.17 76.96,38.1 93.73,38.1 94.49,38.86 94.49,41.15 JP3.6
GND  (via drill 0.51, 0.6)
  Top 0.406: 25.6,6.1 25.4,6.35
  other vias: 21.59,6.86 21.59,5.84 21.59,4.83 21.59,3.81 21.59,2.79 29.21,2.79 29.21,3.81 29.21,4.83 29.21,5.84 29.21,6.86 21.59,49.28 18.8,36.32 17.27,33.27 37.08,35.31 58.93,38.86 60.2,38.86 61.47,38.86 64.26,38.86 65.53,38.86 66.8,38.86 17.27,60.96 34.54,67.31 40.89,67.82 81.79,52.07 21.59,0.76 21.59,1.78 20.57,1.78 29.21,0.76 29.21,1.78 20.57,0.76 47.75,46.48 13.46,36.32 63.25,56.13 42.42,61.47 13.97,73.41 19.3,73.15 36.83,68.58 52.07,49.02 34.29,36.07 29.21,27.43 26.16,60.2 29.46,56.64 30.23,0.76 30.23,1.78 20.57,2.79 58.93,37.85 60.2,37.85 61.47,37.85 64.26,37.85 65.53,37.85 65.53,41.66 65.53,42.67 71.88,65.79 70.87,65.79 72.9,65.79 54.36,66.04 55.37,66.04 53.34,66.04 19.56,59.94 44.96,8.13 47.75,5.59 68.07,38.86 92.96,41.66 14.22,60.45 11.94,60.2 8.89,71.37 11.68,72.39 6.35,70.1 10.16,69.85 8.13,64.01 5.33,44.96 39.88,60.96 65.53,43.69 64.52,43.69 63.5,43.69 62.48,43.69 61.47,43.69 60.45,43.69 57.91,38.86 64.52,44.7 63.5,44.7 62.48,44.7 61.47,44.7 63.5,45.72 62.48,45.72 56.9,38.86 22.86,6.35 23.88,6.35 24.89,6.35 25.91,6.35 26.92,6.35 27.94,6.35 27.94,5.33 26.92,5.33 25.91,5.33 24.89,5.33 23.88,5.33 22.86,5.33 22.86,8.38 24.89,9.4 25.91,9.4 26.92,7.37 26.92,9.4 27.94,7.37 27.94,8.38 27.94,9.4 26.92,8.38 25.91,7.37 24.89,7.37 22.86,9.4 23.88,8.38 23.88,9.4 24.89,8.38 25.91,8.38 26.92,2.79 27.94,2.79 30.23,2.79 30.23,3.81 30.23,4.83 31.24,0.76 31.24,1.78 31.24,2.79 31.24,3.81 31.24,4.83 20.57,3.81 20.57,4.83 20.57,5.84 20.57,6.86 21.59,7.87 20.57,7.87 21.59,8.89 22.86,7.37 23.88,7.37 37.08,24.89 25.91,2.79 24.89,2.79 27.94,1.78 26.92,1.78 25.91,1.78 24.89,1.78 23.88,1.78 22.86,1.78 23.88,2.79 22.86,2.79 22.86,0.76 23.88,0.76 24.89,0.76 25.91,0.76 26.92,0.76 27.94,0.76 29.21,7.87 30.48,29.46
  pour Bottom (isolate 0.305): 0,83.06 100.08,82.8 99.82,-0.25 0,0
  pour Top: 0.25,26.16 0,9.91 8.64,9.91 11.43,12.7 11.43,26.16
  pour Top: 99.82,15.24 92.46,15.24 83.57,24.13 83.57,30.23 83.31,30.48 61.47,30.48 57.15,34.8 39.88,34.8 38.86,33.78 26.42,33.78 25.15,32.51 25.15,30.48 27.94,27.69 31.5,27.69 35.81,23.37 35.81,19.56 49.78,5.59 49.78,0 99.82,0
  pour Top: 49.02,0.25 49.02,5.08 35.05,19.05 35.05,22.86 28.96,28.96 12.19,28.96 12.19,12.45 8.89,9.14 0.25,9.14 0.25,0 48.77,0
  pour Top: 100.08,16 92.96,16 84.33,24.64 84.33,30.73 83.31,31.75 61.47,31.75 57.66,35.56 39.37,35.56 38.35,34.54 28.45,34.54 26.67,32.77 27.43,27.69 25.15,27.43 11.43,27.18 11.43,23.37 7.87,23.37 4.06,27.18 0.25,27.18 0.25,83.06 0.51,83.31 100.33,83.31 100.58,83.06 100.58,16.51
  pour Top: 70.1,51.05 70.1,32.77 69.09,31.75 61.21,31.75 54.86,38.1 54.86,52.32 68.58,52.32 69.85,51.05
INT  (via drill 0.51)
  Top 0.254: U2.4 33.27,72.64 U$3.12 | v68.33,52.07 76.96,52.07 U3.3
  Bottom 0.254: U2.4 33.27,62.48 32,61.21 32,56.9 32.77,56.13 59.94,56.13 62.99,53.09 67.31,53.09 v68.33,52.07
IR
  Top 0.254: 53.34,51.05 D10000-1.5 53.34,47.75 48.26,42.67 32,42.67 U6.6
LED_LINK
  Top 0.254: R2.2 81.03,79.76 86.11,79.76 97.03,68.83 97.03,67.06 98.12,65.96 J1.9
LED_STATUS
  Top 0.254: R1.2 85.6,81.28 91.44,75.44 94.56,75.44 J1.12
MISO  (via drill 0.51, 0.6)
  Top 0.254: v4.06,72.64 5.08,73.66 U$3.2 | v45.97,53.09 46.74,52.32 66.55,52.32 67.82,51.05 70.36,51.05 U3.6 | v17.78,56.13 17.78,54.86 v15.49,52.58
  Bottom 0.254: v4.06,72.64 9.91,72.64 11.68,70.87 11.68,61.72 U2.18 16,57.91 v17.78,56.13 | v45.97,53.09 40.13,53.09 39.62,53.59 19.81,53.59 18.8,52.58 v15.49,52.58
MOSI  (via drill 0.51)
  Top 0.254: v7.62,69.6 U$3.3 | U1.7 61.98,57.4 59.44,54.86 v50.8,54.86
  Bottom 0.254: v7.62,69.6 9.14,68.07 9.14,61.72 U2.17 16,54.86 v50.8,54.86
N$1
  Top 0.254: Q4.1 5.18,19.2 5.18,20.12 U7.2
N$2
  Top 0.254: Q4.2 2.74,19.2 2.74,20.12 U7.1
N$3
  Bottom 0.254: U7.3 9.4,22.1 10.92,22.1 12.7,20.32 BAT100.V+
N$4
  Top 0.254: U10.2 22.61,26.16 C28.+
N$5
  Top 0.254: U10.4 20.32,23.37 C28.-
N$6
  Top 0.254: U9.6 C31.2 68.58,13.97 R25.1
  Bottom 0.254: RV3.3 80.16,3.96 80.16,8.23 71.63,8.23 68.58,11.28 R25.1
N$7
  Top 0.254: R25.2 68.58,6.35 63.25,11.68 R22.1
  Bottom 0.254: U8.2 60.71,17.78 R22.1
N$8
  Top 0.254: R20.2 82.8,25.4 C23.1
  Bottom 0.254: U9.3 75.95,24.38 81.03,24.38 R20.2
N$10  (via drill 0.51)
  Top 0.254: v95.76,40.13 95.76,50.04 JP3.3
  Bottom 0.254: v95.76,40.13 95.76,29.72 86.61,20.57 RV1.2
N$11
  Top 0.406: R24.2 68.33,1.52 75.18,1.52 RV3.2
N$12
  Top 0.254: U8.3 58.93,20.32 R21.2 60.71,20.57 65.79,20.57 R19.2
N$13
  Top 0.254: X1.1 87.12,9.91 87.12,12.45 85.34,14.22 C34.1 82.04,17.27 R20.1
N$14
  Top 0.254: R24.1 66.04,13.97 C31.1 69.34,17.27 69.34,19.81 U9.2 78.74,29.21 R15.2
N$15
  Top 0.254: 57.66,15.24 U8.1 | 57.66,15.24 59.94,17.53 63.25,17.53 R18.1 | R22.2 63.25,9.14 61.47,10.92 61.47,13.46 59.69,15.24 57.66,15.24
N$16
  Top 0.254: U8.5 C25.1 62.23,26.67 R18.2
N$17
  Top 0.254: 57.3,30.48 57.3,28.04 U8.6 | 57.3,30.48 57.3,33.22 R13.1 | 57.3,30.48 U8.7
N$18
  Top 0.254: R13.2 46.99,30.73 C24.1 U8.10
N$19
  Bottom 0.254: U8.12 56.39,13.46 74.17,13.46 RV2.2
N$20
  Bottom 0.254: U8.13 U8.14 53.34,15.24 56.64,11.94 R21.1
N$21
  Top 0.254: U8.9 49.68,28.04 49.68,30.48 U8.8
  Bottom 0.254: U8.8 44.45,30.48 R14.1
N$22
  Top 0.254: RV2.1 74.68,10.06 74.68,8.53 71.63,5.49 71.63,3.96 71.32,3.66 R26.1
N$23
  Top 0.254: R27.2 84.07,10.16 RV2.3
N$24
  Bottom 0.406: R23.1 7.62,10.92 LED1.A
N$25
  Top 0.254: D10000-1.4 55.88,49.53 48.51,42.16 34.04,42.16 U6.5
N$26
  Bottom 0.254: U2.26 35.81,60.71 39.62,64.52 39.62,70.36 43.18,73.91 44.2,73.91 U$3.18
N$27
  Bottom 0.254: U2.25 33.27,60.71 37.08,64.52 37.08,66.55 38.35,67.82 38.35,70.61 U$3.17
N$28
  Bottom 0.254: D10000-1.6 48.26,48.26 43.94,48.26 41.66,45.97 16.26,45.97 13.97,43.69 13.97,41.4 U6.11
N$29
  Bottom 0.254: D10000-1.7 46.74,49.28 43.94,49.28 41.15,46.48 16,46.48 13.46,43.94 U6.12
N$30
  Bottom 0.406: U1.1 46.74,57.91 C10.2
N$31
  Bottom 0.254: JP9.1 50.8,7.87 39.62,19.05 39.62,25.15 37.85,26.92 34.54,26.92 29.72,31.75 U6.23
N$32
  Bottom 0.254: JP9.2 53.34,6.1 40.13,19.3 40.13,25.4 38.1,27.43 34.8,27.43 31.24,30.99 U6.24
N$33
  Top 0.254: U1.14 83.06,58.42 R6.1
N$34
  Bottom 0.254: JP9.3 55.12,3.3 55.12,5.08 40.64,19.56 40.64,25.65 38.35,27.94 35.31,27.94 33.78,29.46 U6.25
N$35
  Top 0.254: R3.2 79.76,75.18 C4.1 82.17,71.75 J1.4 87.5,71.75 88.9,70.36 92.43,63.81 L1.2 92.46,61.96 91,60.5 91,53.16 R8.2
N$36
  Top 0.254: U6.9 22.35,40.64 Q3.3
N$37
  Top 0.254: C13.1 R9.2 91.13,50.5 88,50.5 86.68,51.82 R7.2
N$38
  Top 0.254: U6.10 17.27,40.64 Q3.1
N$39  (via drill 0.51)
  Top 0.254: U1.27 49.78,69.34 50.8,70.36 v50.8,81.53
  Bottom 0.254: R2.1 69.34,81.79 51.05,81.79 v50.8,81.53
N$40
  Top 0.254: JP4.2 35.56,54.36 22.35,54.36 8.89,40.89 7.87,40.89 7.11,40.13 7.11,33.02 U6.15
N$42
  Top 0.254: R1.1 72.14,81.53 53.34,81.53 51.56,79.76 51.56,69.6 U1.26
N$43
  Top 0.813: JP10.1 11.18,3.04 D1.A
N$45
  Top 0.203: 26.67,48.01 JP4.8
  Top 0.254: 26.67,48.01 27.43,47.24 27.43,36.58 23.62,32.77 U6.21
N$47
  Bottom 0.254: U2.24 30.73,63.5 32,64.77 32,66.8 U$3.16
N$49  (via drill 0.51)
  Top 0.254: D10000-1.1 61.72,49.02 57.66,49.02 49.28,40.64 40.13,40.64 U6.2 33.78,34.29 v33.02,34.29
  Bottom 0.254: v33.02,34.29 10.16,34.29 3.3,41.15 FTDI2.4
N$50  (via drill 0.51)
  Top 0.254: D10000-1.2 59.69,49.53 57.4,49.53 49.02,41.15 38.1,41.15 U6.3 32.26,35.31 v31.5,35.31
  Bottom 0.254: v31.5,35.31 9.91,35.31 4.06,41.15 4.06,42.16 FTDI2.5
N$51
  Bottom 0.254: C14.2 2.54,46.99 FTDI2.6
N$52
  Bottom 0.254: U2.23 28.19,63.25 26.92,64.52 26.92,66.04 33.02,72.14 35.05,72.14 38.1,75.18 U$3.15
N$53
  Top 0.254: U$3.14 38.35,72.64 U2.2 38.35,64.52 36.32,62.48 6.86,62.48 4.83,60.45 4.83,59.18 3.3,57.66 FTDI1.4
N$54
  Top 0.254: U$3.13 35.81,72.64 U2.3 35.56,65.53 33.02,62.99 6.6,62.99 3.81,60.2 FTDI1.5
N$56
  Top 0.254: U2.5 30.73,72.64 U$3.11
N$57
  Top 0.254: U2.6 28.19,72.64 U$3.10
N$58
  Top 0.254: U2.11 15.49,69.6 17.53,71.63 19.05,71.63 U$3.9
N$59
  Top 0.254: U2.12 12.95,68.07 U$3.8
N$60
  Top 0.254: U2.13 10.41,66.55 17.78,73.91 U$3.7
N$61
  Top 0.254: U2.14 15.24,72.9 U$3.6
N$62  (via drill 0.51)
  Top 0.254: U$3.5 12.7,74.93 13.21,74.42 13.21,71.63 8.64,67.06 v6.6,67.06 | U2.15 7.87,59.69 v6.86,60.71
  Bottom 0.254: v6.86,60.71 6.35,61.21 6.35,66.8 v6.6,67.06
N$67
  Top 0.254: U2.10 Q2.1
N$68
  Top 0.254: U2.9 23.11,68.07 Q2.3
N$69  (via drill 0.51)
  Top 0.254: C12.2 7.87,54.61 7.87,55.63 v6.1,57.4
  Bottom 0.254: v6.1,57.4 4.06,59.44 4.06,61.21 FTDI1.6
OSC1
  Top 0.254: U1.23 C6.2 61.98,75.82 Q1.1
OSC2
  Top 0.254: U1.24 C5.2 59.44,74.3 Q1.2
RESET  (via drill 0.51, 0.6)
  Top 0.254: v29.21,37.34 24.89,33.02 24.89,29.21 v27.69,26.42
  Bottom 0.254: U6.1 39.37,37.34 v29.21,37.34 8.64,37.34 7.11,38.86 7.11,46.99 R12.1 C14.1 | JP8.6 33.02,8.38 29.46,11.94 29.46,24.64 v27.69,26.42
RESET2
  Top 0.254: U2.1 40.89,65.02 37.08,61.21 19.3,61.21 16.76,58.67 16.76,56.9 15.24,55.37 R11.2 11.68,53.09 C12.1 | U1.10 67.82,59.94 R5.1
  Bottom 0.254: U1.10 66.29,65.02 41.4,65.02 U2.1
RS
  Bottom 0.254: U5.14 84.33,40.89 89.15,40.89 JP3.4
SCK  (via drill 0.51)
  Top 0.254: U2.19 18.8,57.91 20.32,59.44 36.58,59.44 v37.34,60.2
  Bottom 0.254: U2.19 14.22,61.72 14.22,71.88 12.19,73.91 3.56,73.91 2.54,74.93 U$3.1 2.54,75.18 | v37.34,60.2 37.59,60.2 41.15,63.75 62.48,63.75 U1.8
SCL  (via drill 0.51)
  Top 0.254: U7.6 7.62,27.69 8.64,26.67 11.18,26.67 R16.1 13.72,28.96 | v43.69,45.97 43.43,45.97 43.18,46.23 43.18,55.63 U2.28 40.89,62.23 42.67,64.01 42.67,72.14 43.43,72.9 JP1.4 | v43.69,37.85 41.4,35.56 U6.28 41.4,29.46 39.88,27.94 34.04,27.94 33.53,28.45 v27.43,28.45
  Bottom 0.254: U5.1 65.79,32 62.43,35.36 48.77,35.36 45.16,31.75 U6.28 41.4,27.18 42.16,26.42 42.16,20.32 56.39,6.1 59.94,6.1 JP9.6 | v43.69,37.85 43.69,40.64 42.93,41.4 42.93,45.21 v43.69,45.97 | R16.1 15.24,27.69 16.76,27.69 19.05,29.97 25.91,29.97 v27.43,28.45
SDA  (via drill 0.51)
  Top 0.254: 10.16,28.19 U7.5 10.16,28.45 12.19,30.48 15.24,30.48 R17.1 | v37.85,48.51 38.86,47.5 v38.86,43.94 | JP1.3 46.48,73.66 43.43,73.66 42.16,72.39 42.16,64.52 38.35,60.71 U2.27 39.12,57.15 v39.12,52.58 | U6.27 37.59,30.48 29.46,30.48 v28.7,29.72
  Bottom 0.254: 42.67,33.53 39.88,33.53 38.86,32.51 U6.27 38.86,28.96 41.66,26.16 41.66,20.07 56.39,5.33 58.17,5.33 JP9.5 | 42.67,33.53 45.47,33.53 48.51,36.58 62.74,36.58 65.79,33.53 73.91,33.53 U5.2 | v38.86,43.94 39.12,43.94 42.67,40.39 42.67,33.53 | v37.85,48.51 37.85,51.31 v39.12,52.58 | R17.1 17.78,30.48 27.43,30.48 27.94,30.48 v28.7,29.72
SS  (via drill 0.51)
  Top 0.254: v7.37,68.07 8.89,69.6 8.89,70.1 10.16,71.37 U$3.4 | U1.9 66.55,61.21 66.55,57.15 R10.1 64.26,55.88 61.98,53.59 v48.51,53.59
  Bottom 0.254: v48.51,53.59 48.01,54.1 12.7,54.1 10.41,56.39 U2.16 10.41,59.44 6.86,62.99 6.86,66.04 7.62,66.8 7.62,67.82 v7.37,68.07
TP1  (via drill 0.51)
  Top 0.254: U1.4 56.9,59.18 R4.1 | U3.1 U3.2 78.49,53.09 68.58,53.09 v68.07,53.59
  Bottom 0.254: R4.1 59.44,57.4 61.98,54.86 63.25,53.59 v68.07,53.59
TP2
  Top 0.254: U3.5 U3.4
  Bottom 0.254: U1.6 63.5,57.66 65.53,57.66 73.41,49.78 U3.5
TPIN+
  Bottom 0.254: U1.13 78.49,62.99 79.76,62.99 86.87,70.1 J1.3 88.65,68.71 88.65,66.55 88.14,66.04 88.14,63.5 91.69,59.94 R9.1
TPIN-
  Bottom 0.254: J1.6 81.53,71.5 81.53,66.04 79.25,63.75 76.71,63.75 U1.12 77.22,59.18 86.35,59.18 R7.1
TPOUT+
  Top 0.254: U1.17 77.22,66.8 85.6,66.8 86.74,67.94 J1.1
  Bottom 0.254: R8.1 89.66,60.71 87.12,63.25 87.12,67.69 J1.1
TPOUT-
  Top 0.254: J1.2 84.33,69.09 83.06,67.82 78.74,67.82 U1.16 70.87,75.69 R3.1
U5VIN  (1 unrouted)
  Top 0.406: C29.- 34.29,18.03 32.77,19.56 U10.5 | 34.29,17.75 34.29,13.11 U11.2
VIN
  Top 0.61: JP8.1 42.16,6.1 33.78,6.1 31.75,8.13 31.75,9.65 27.32,14.09 U12.1 | C32.2 27.69,23.11 U10.8
  Top 0.813: D1.C 15.47,7.37 C37.P$2 | C32.2 U12.1
  Bottom 0.813: C37.P$2 17.78,7.11 22.1,11.43 24.66,11.43 U12.1 C32.2
VPH
  Bottom 0.254: U6.26 36.32,29.97 R14.2 37.85,29.21 41.15,25.91 41.15,19.81 JP9.4

### Text on the board
tNames: GND | 5V | SDA | D9 | D8 | D7 | D6 | D5 | D4 | D3 | D2 | D1 | D0 | A0 | A1 | A2 | A3 | SCL | D13 | D12 | D11 | D10 | DTR | RX | TX | 1 | 1 | A Controller for Reef Aquaria | 5V | v1.0 11/24/10 by N. Enders and Others | (CC) BY-SA-NC 3.0 | GND | 9 | 8 | 7 | 6 | 5 | 4 | 3 | 2 | 1 | 0 | DTR | 13 | 12 | 11 | 10 | hydra | GND | Digital | AREF | RX | www.hydra-reef.com | TX | 5V | GND | 16 | PWR | Analog | RST | 3V3 | 5V | GND | GND | Vin | 0 | 1 | 2 | 3 | 4 | 5 | GND | Vin
200bmp: C:/DevFiles/tempsite/DevFiles/files/trace.bmp